# Altium schematic sheet ETH.SchDoc: LED Cube 8x8x8 - Ethernet
size A4; Author: Luka Penger; CompanyName: L. Penger; DrawnBy: Luka Penger; Organization: L. Penger; Address1: Luka Penger; Address2: http://lukapenger.eu; Address3: Software & Hardware; Address4: Development; DocumentNumber: 4; Revision: 1.0.0; SheetNumber: 4; SheetTotal: 4; DocumentName: ETH; ProjectName: LED Cube 8x8x8
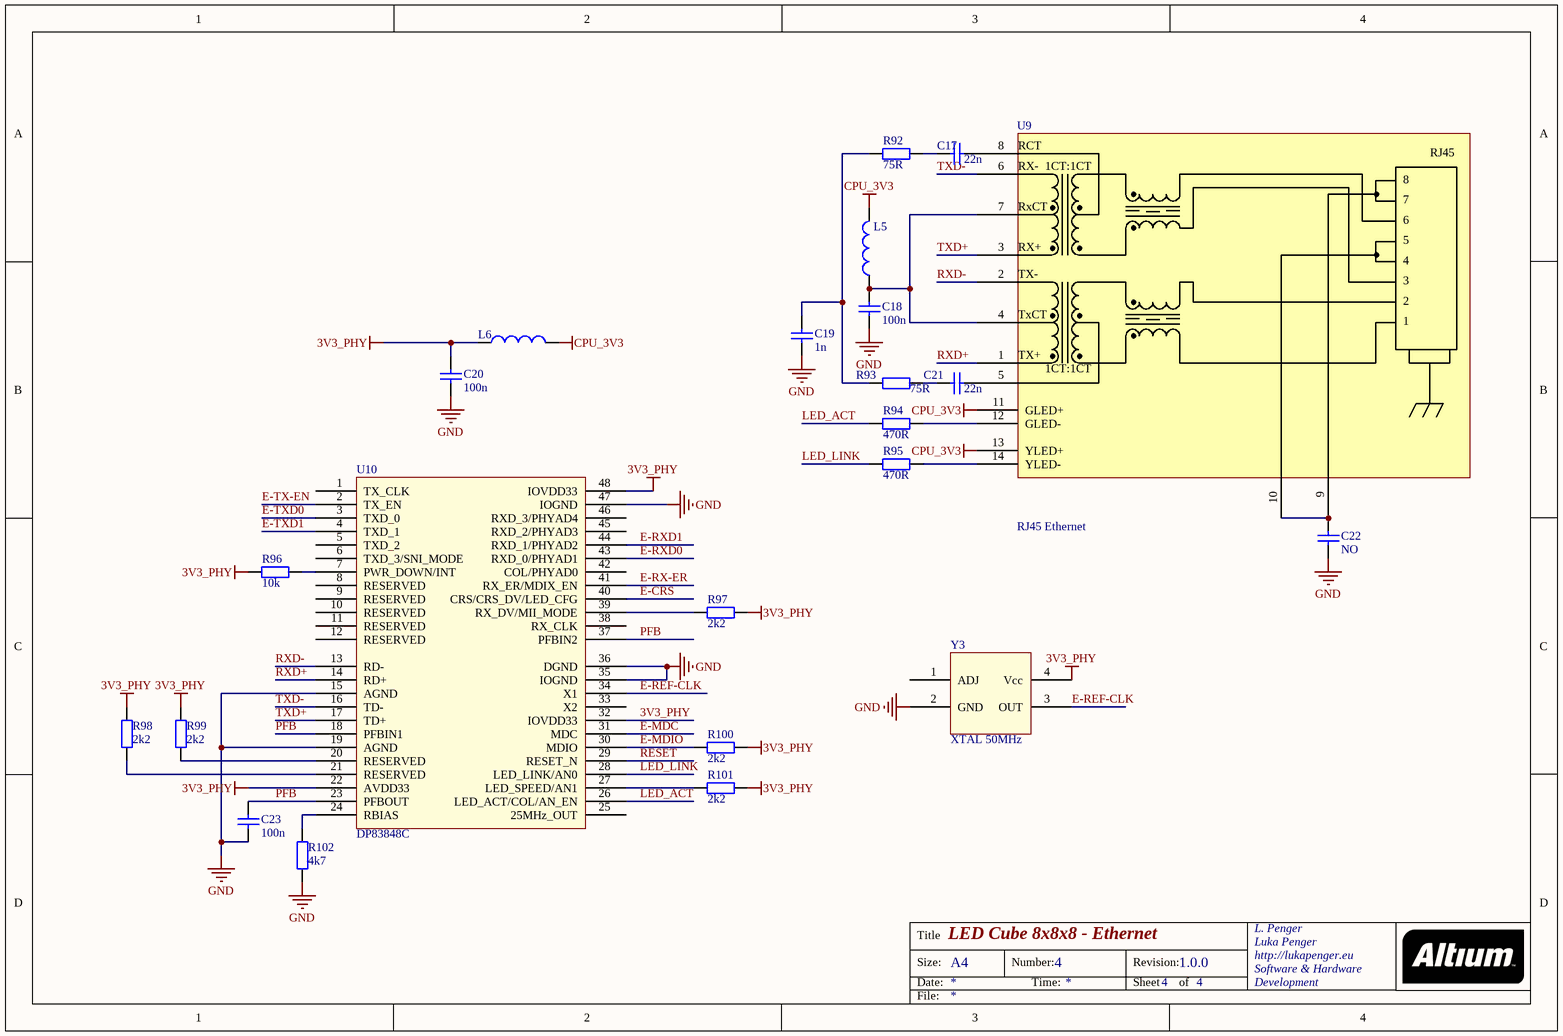
[diagram p0: ETH.SchDoc]

## Parts
C17  22n  [1608[0603]]
C18  100n  [1608[0603]]
C19  1n  [1608[0603]]
C20  100n  [1608[0603]]
C21  22n  [1608[0603]]
C22  NO  [1608[0603]]
C23  100n  [6-0805_L]
L5  Inductor  [1608[0603]]  (value not drawn)
L6  Inductor  [1608[0603]]  (value not drawn)
R92  75R  [1608[0603]]
R93  75R  [1608[0603]]
R94  470R  [1608[0603]]
R95  470R  [1608[0603]]
R96  10k  [1608[0603]]
R97  2k2  [1608[0603]]
R98  2k2  [1608[0603]]
R99  2k2  [1608[0603]]
R100  2k2  [1608[0603]]
R101  2k2  [1608[0603]]
R102  4k7  [1608[0603]]
U9  RJ45 Ethernet  [RJ45 Ethernet connector]
U10  DP83848C  [DP83848C]
Y3  XTAL 50MHz  [XTAL ACT9200]

## Nets
3V3_PHY: C20.1 L6.1 R96.2 R97.1 R98.1 R99.2 R100.1 R101.1 U10.22(AVDD33) U10.32(IOVDD33) U10.48(IOVDD33) Y3.4(Vcc)
CPU_3V3: L5.2 L6.2 U9.11(GLED+) U9.13(YLED+)
GND: C18.2 C19.2 C20.2 C22.1 C23.2 R102.2 U10.15(AGND) U10.19(AGND) U10.35(IOGND) U10.36(DGND) U10.47(IOGND) Y3.2(GND)
E-CRS: U10.40(CRS/CRS_DV/LED_CFG)
E-MDC: U10.31(MDC)
E-MDIO: R100.2 U10.30(MDIO)
E-REF-CLK: U10.34(X1) Y3.3(OUT)
E-RX-ER: U10.41(RX_ER/MDIX_EN)
E-RXD0: U10.43(RXD_0/PHYAD1)
E-RXD1: U10.44(RXD_1/PHYAD2)
E-TX-EN: U10.2(TX_EN)
E-TXD0: U10.3(TXD_0)
E-TXD1: U10.4(TXD_1)
LED_ACT: R94.2 U10.26(LED_ACT/COL/AN_EN)
LED_LINK: R95.2 U10.28(LED_LINK/AN0)
PFB: C23.1 U10.18(PFBIN1) U10.23(PFBOUT) U10.37(PFBIN2)
~{RESET}: U10.29(RESET_N)
RXD+: U9.1 U10.14(RD+)
RXD-: U9.2 U10.13(RD-)
TXD+: U9.3 U10.17(TD+)
TXD-: U9.6 U10.16(TD-)
NetC17_1: C17.1 U9.8
NetC17_2: C17.2 R92.1
NetC18_1: C18.1 L5.1 U9.4 U9.7
NetC19_1: C19.1 R92.2 R93.1
NetC21_1: C21.1 U9.5
NetC21_2: C21.2 R93.2
NetC22_2: C22.2 U9.9 U9.10
NetR94_1: R94.1 U9.12(GLED-)
NetR95_1: R95.1 U9.14(YLED-)
NetR96_1: R96.1 U10.7(PWR_DOWN/INT)
NetR97_2: R97.2 U10.39(RX_DV/MII_MODE)
NetR98_2: R98.2 U10.21(RESERVED)
NetR99_1: R99.1 U10.20(RESERVED)
NetR101_2: R101.2 U10.27(LED_SPEED/AN1)
NetR102_1: R102.1 U10.24(RBIAS)

Not connected (* = marked no-connect by the designer): U10 1(TX_CLK) 5(TXD_2) 6(TXD_3/SNI_MODE) 8(RESERVED) 9(RESERVED) 10(RESERVED) 11(RESERVED) 12(RESERVED) 25(25MHz_OUT) 33(X2) 38(RX_CLK) 42(COL/PHYAD0) 45(RXD_2/PHYAD3) 46(RXD_3/PHYAD4); Y3 1(ADJ)

## Notes on the sheet
- Title
- Size:
- Date:
- A4
- Number:
- Time:
- Revision:
- Sheet
- of
- File:
- (in symbol RJ45 Ethernet) RCT; RJ45; RX-; 1CT:1CT; RxCT; RX+; TX-; TxCT; TX+

## Library data of the parts
C17-C23 = Cap: Capacitor; Value: 100pF; Published: 8-Jun-2000; LatestRevisionDate: 17-Jul-2002; LatestRevisionNote: Re-released for DXP Platform.; PackageReference: RAD-0.3; Publisher: Altium Limited; PackageDescription: Radial Cap, Thru-Hole; 2 Leads; 0.3 in Pin Spacing
L5 L6 = Inductor: Code_IEC: 1005; Value: 10mH; Published: 8-Jun-2000; LatestRevisionDate: 29-May-2009; LatestRevisionNote: IPC-7351 Footprint Added.; PackageReference: 0402-A; Publisher: Altium Limited; PackageDescription: Chip Inductor; Code_JEITA: 0402
R92-R102 = Res2: Resistor; Value: 1K; Published: 8-Jun-2000; LatestRevisionDate: 17-Jul-2002; LatestRevisionNote: Re-released for DXP Platform.; PackageReference: AXIAL-0.4; Publisher: Altium Limited; PackageDescription: Axial Device, Thru-Hole; 2 Leads; 0.4 in Pin Spacing
U9 = RJ45 Ethernet: Ethernet Connector
U10 = DP83848C: Ethernet PHY
Y3 = XTAL ACT9200